# EAGLE design A4988Board (EAGLE 9.4.2)
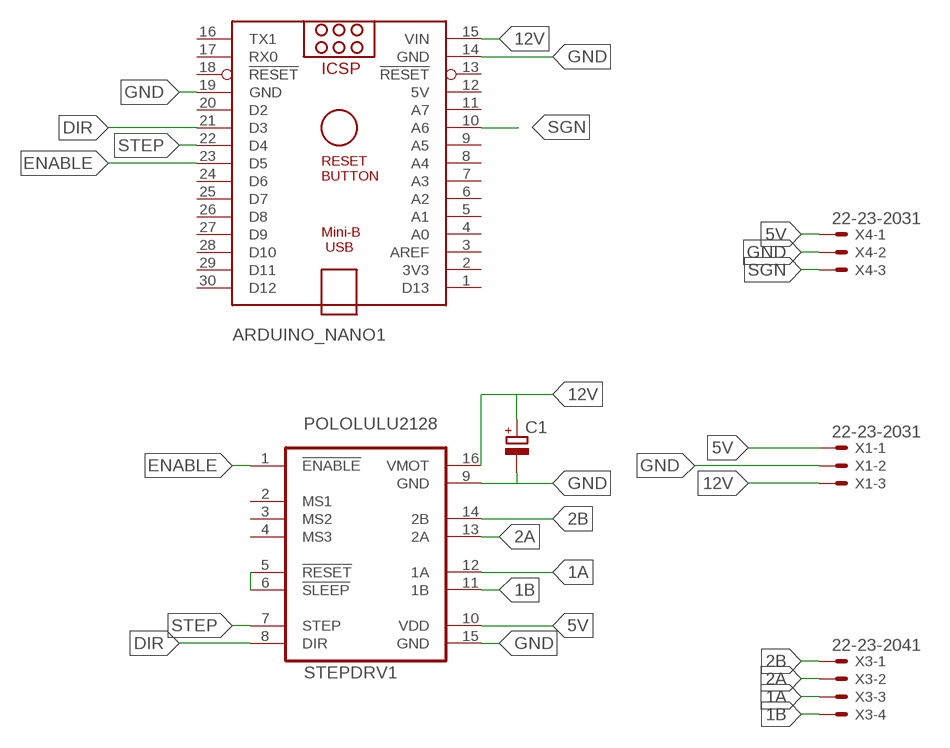
[diagram p0: schematic, sheet 1]

## Parts
ARDUINO_NANO1  ARDUINO_NANO  [ARDUINO_NANO]
C1  CPOL-EUE2.5-6  [E2,5-6]
STEPDRV1  POLOLULU2128  [POLOLULU2128]
X1  22-23-2031  [22-23-2031]
X3  22-23-2041  [22-23-2041]
X4  22-23-2031  [22-23-2031]

## Nets
1A: STEPDRV1.12(1A) X3.3
1B: STEPDRV1.11(1B) X3.4
2A: STEPDRV1.13(2A) X3.2
2B: STEPDRV1.14(2B) X3.1
5V: STEPDRV1.10(VDD) X1.1 X4.1
12V: ARDUINO_NANO1.15(VIN) C1.+ STEPDRV1.16(VMOT) X1.3
DIR: ARDUINO_NANO1.21(D3) STEPDRV1.8(DIR)
ENABLE: ARDUINO_NANO1.23(D5) STEPDRV1.1(!ENABLE)
GND: ARDUINO_NANO1.14(GND) ARDUINO_NANO1.19(GND) C1.- STEPDRV1.9(GND) STEPDRV1.15(GND) X1.2 X4.2
N$2: STEPDRV1.5(!RESET) STEPDRV1.6(!SLEEP)
SGN: ARDUINO_NANO1.10(A6) X4.3
STEP: ARDUINO_NANO1.22(D4) STEPDRV1.7(STEP)
Unconnected: ARDUINO_NANO1.1(D13) ARDUINO_NANO1.2(3V3) ARDUINO_NANO1.3(AREF) ARDUINO_NANO1.4(A0) ARDUINO_NANO1.5(A1) ARDUINO_NANO1.6(A2) ARDUINO_NANO1.7(A3) ARDUINO_NANO1.8(A4) ARDUINO_NANO1.9(A5) ARDUINO_NANO1.11(A7) ARDUINO_NANO1.13(!RESET) ARDUINO_NANO1.16(TX1) ARDUINO_NANO1.17(RX0) ARDUINO_NANO1.18(!RESET) ARDUINO_NANO1.20(D2) ARDUINO_NANO1.24(D6) ARDUINO_NANO1.25(D7) ARDUINO_NANO1.26(D8) ARDUINO_NANO1.27(D9) ARDUINO_NANO1.28(D10) ARDUINO_NANO1.29(D11) ARDUINO_NANO1.30(D12) STEPDRV1.2(MS1) STEPDRV1.3(MS2) STEPDRV1.4(MS3)

## Power pins joined to a net without a drawn wire
5V: ARDUINO_NANO1.12(5V)

## Library data of the parts
ARDUINO_NANO1 = ArduinoNanoV30:ARDUINO_NANO: Arduino Nano V3.0 Overview: The Arduino Nano is a small, complete, and breadboard-friendly board based on the ATmega328 (Arduino Nano 3.x) or ATmega168 (Arduino Nano 2.x). It has more or less the same functionality of the Arduino Duemilanove, but in a different package. It lacks only a DC power jack, and works with a Mini-B USB cable instead of a standard one. The Nano was designed and is being produced by Gravitech. Specifications: Microcontroller Atmel ATmega168 or ATmega328 Operating Voltage (logic level) 5 V Input Voltage (recommended) 7-12 V Input Voltage (limits) 6-20 V Digital I/O Pins 14 (of which 6 provide PWM output) Analog Input Pins 8 DC Current per I/O Pin 40 mA Flash Memory 16 KB (ATmega168) or 32 KB (ATmega328) of which 2 KB used by bootloader SRAM 1 KB (ATmega168) or 2 KB (ATmega328) EEPROM 512 bytes (ATmega168) or 1 KB (ATmega328) Clock Speed 16 MHz Dimensions 0.73" x 1.70" Length 45 mm Width 18 mm Weigth 5 g Power: The Arduino Nano can be powered via the Mini-B USB connection, 6-20V unregulated external power supply (pin 30), or 5V regulated external power supply (pin 27). The power source is automatically selected to the highest voltage source. Memory: The ATmega168 has 16 KB of flash memory for storing code (of which 2 KB is used for the bootloader); the ATmega328 has 32 KB, (also with 2 KB used for the bootloader). The ATmega168 has 1 KB of SRAM and 512 bytes of EEPROM (which can be read and written with the EEPROM library); the ATmega328 has 2 KB of SRAM and 1 KB of EEPROM. Input and Output: Each of the 14 digital pins on the Nano can be used as an input or output, using pinMode(), digitalWrite(), and digitalRead() functions. They operate at 5 volts. Each pin can provide or receive a maximum of 40 mA and has an internal pull-up resistor (disconnected by default) of 20-50 kOhms. In addition, some pins have specialized functions. Visit Arduino - ArduinoBoardNano <https://www.arduino.cc/en/Main/ArduinoBoardNano>
C1 = rcl:CPOL-EU: POLARIZED CAPACITOR, European symbol; SPICEPREFIX: C
STEPDRV1 = stepper_drivers_etc:POLOLULU2128
X1 X4 = con-molex:22-23-2031: .100" (2.54mm) Center Header - 3 Pin; MF: MOLEX; MPN: 22-23-2031; OC_FARNELL: 1462950; OC_NEWARK: 30C0862
X3 = con-molex:22-23-2041: .100" (2.54mm) Center Header - 4 Pin; MF: MOLEX; MPN: 22-23-2041; OC_FARNELL: 1462920; OC_NEWARK: 38C0355

## Board
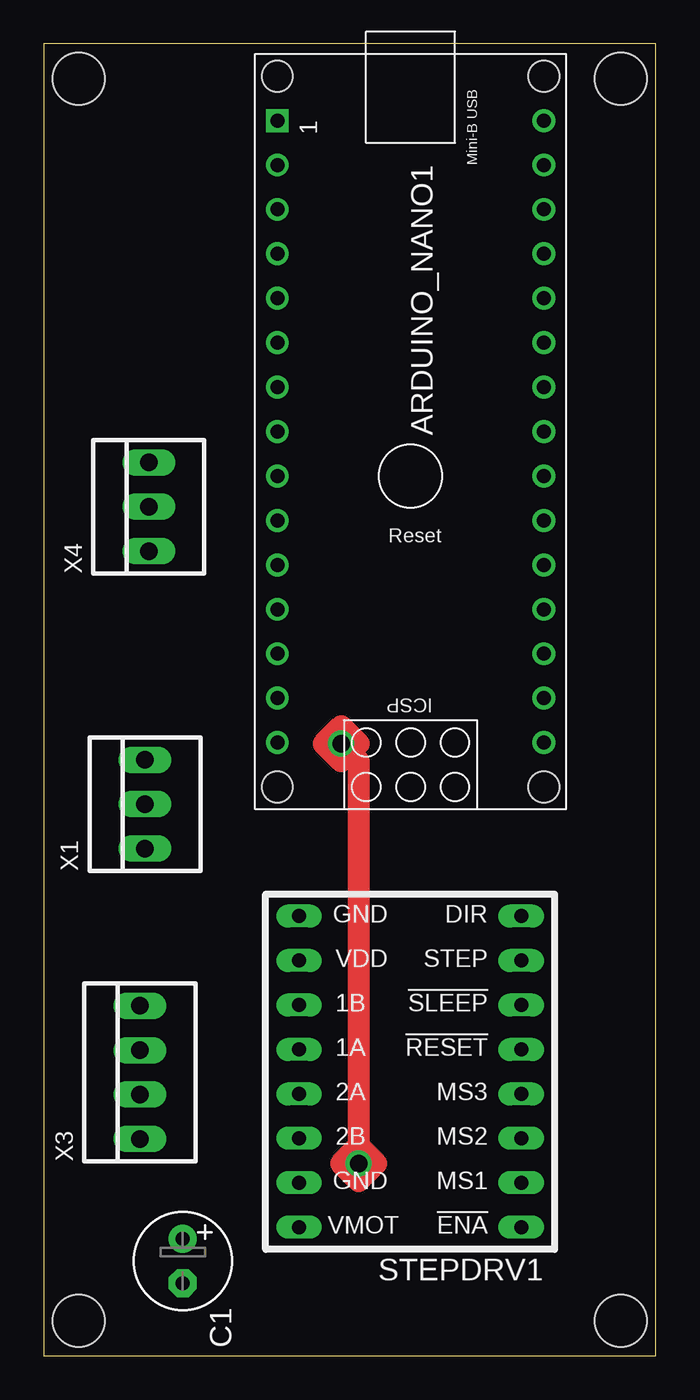
[diagram p1: board, top side]
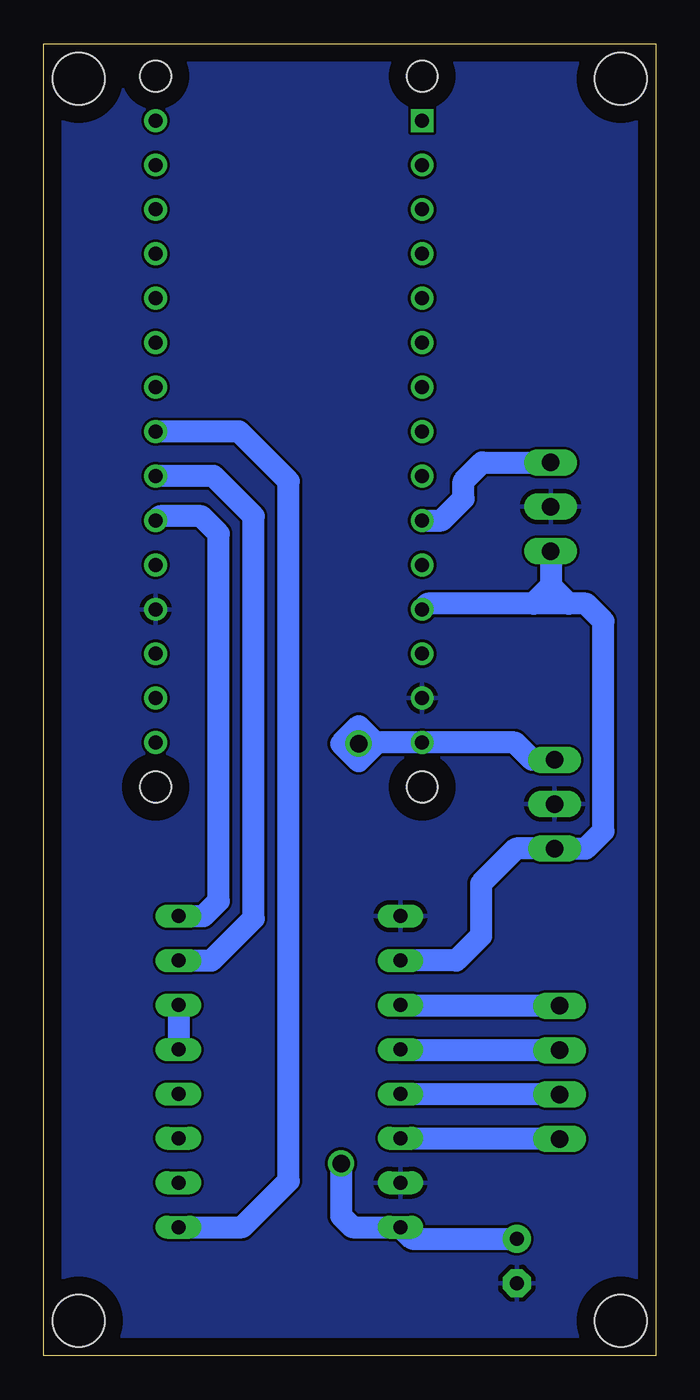
[diagram p2: board, bottom side, seen from below]

Size 35 x 75 mm. Coordinates in mm from the lower left corner, seen from the top.
Outline: 0,0 35,0 35,75 0,75 0,0
Copper layers (1*16): Top 0.035mm / dielectric 1.5mm / Bottom 0.035mm
Design rules "default": minimum track width 6mil, minimum drill 0.35mm, track to track 6mil, track to pad 6mil, pad to pad 6mil, via to via 6mil, smd to smd 6mil, copper to edge 40mil, drill to drill 6mil, minimum pad ring 10mil, minimum via ring 8mil, stop-mask expansion 4mil, vias tented up to drill 0mil, thermal gap 10mil
Holes 3 mm at 2,2 33,2 33,73 2,73

### Footprints (pad centres in the part's own frame; a part is rotated, then mirrored left to right if it is on the bottom)
ARDUINO_NANO = drill 0.8 square: 1 -20.32,-7.62 | drill 0.8: 2 -17.78,-7.62; 3 -15.24,-7.62; 4 -12.7,-7.62; 5 -10.16,-7.62; 6 -7.62,-7.62; 7 -5.08,-7.62; 8 -2.54,-7.62; 9 0,-7.62; 10 2.54,-7.62; 11 5.08,-7.62; 12 7.62,-7.62; 13 10.16,-7.62; 14 12.7,-7.62; 15 15.24,-7.62; 16 15.24,7.62; 17 12.7,7.62; 18 10.16,7.62; 19 7.62,7.62; 20 5.08,7.62; 21 2.54,7.62; 22 0,7.62; 23 -2.54,7.62; 24 -5.08,7.62; 25 -7.62,7.62; 26 -10.16,7.62; 27 -12.7,7.62; 28 -15.24,7.62; 29 -17.78,7.62; 30 -20.32,7.62 | hole 1.778: -22.86,-7.62; -22.86,7.62; 17.78,7.62; 17.78,-7.62
E2,5-6 = drill 0.813 pad 1.6: + -1.27,0 | drill 0.813 pad 1.6 octagon: - 1.27,0
POLOLULU2128 = drill 0.8 long: 1 -7.62,7.62; 2 -7.62,5.08; 3 -7.62,2.54; 4 -7.62,0; 5 -7.62,-2.54; 6 -7.62,-5.08; 7 -7.62,-7.62; 8 -7.62,-10.16; 9 5.08,-10.16; 10 5.08,-7.62; 11 5.08,-5.08; 12 5.08,-2.54; 13 5.08,0; 14 5.08,2.54; 15 5.08,5.08; 16 5.08,7.62
22-23-2031 = drill 1 long: 1 -2.54,0; 2 0,0; 3 2.54,0
22-23-2041 = drill 1 long: 1 -3.81,0; 2 -1.27,0; 3 1.27,0; 4 3.81,0

### Placement (x,y rotation side)
ARDUINO_NANO1  20.98,50.29 270 top
C1  7.95,5.42 270 top
STEPDRV1  19.68,14.97 180 top
X1  5.79,31.53 90 top
X3  5.5,16.2 90 top
X4  6.01,48.53 90 top

### Tracks (layer width: path | path; a pad name or v marks a point on that pad's centre or on a via)
1A
  Bottom 1.27: X3.3 14.56,17.47 STEPDRV1.12
1B
  Bottom 1.27: X3.4 14.56,20.01 STEPDRV1.11
2A
  Bottom 1.27: X3.2 14.56,14.93 STEPDRV1.13
2B
  Bottom 1.27: X3.1 14.56,12.39 STEPDRV1.14
5V
  Bottom 1.27: STEPDRV1.10 11.41,22.59 10,24 10,27 8,29 7.99,28.99 X1.1 4.01,28.99 3,30 3,42 4,43 5,43 | 5,43 7,43 | 7,43 13.03,43 ARDUINO_NANO1.12 | X4.1 6.01,44.01 | 6.01,44.01 5,43 | 6.01,44.01 6.01,43.99 7,43
12V  (via drill 1)
  Top 1.27: 16,35 v17,35 18,34 18,12 | 16,35 17,36 18,35 17,34 16,35 | v18,11 18,10 | v18,11 19,11 | v18,11 17,11 | 17,11 18,12 | 18,12 19,11 | 19,11 18,10 | 18,10 17,11
  Bottom 1.27: C1.+ 13.94,6.69 STEPDRV1.16 17.35,7.35 18,8 v18,11 | X1.3 7.07,34.07 8.05,35.05 ARDUINO_NANO1.15 16,35.05 | v17,35 17,36 | v17,35 18,35 | v17,35 17,34 | 17,34 16,35 16,35.05 | 16,35.05 16.05,35.05 17,36 | 17,36 18,35 | 18,35 17,34
DIR
  Bottom 1.27: STEPDRV1.8 25.87,25.13 25,26 25,47 26,48 28.35,48 ARDUINO_NANO1.21
ENABLE
  Bottom 1.27: STEPDRV1.1 23.65,7.35 21,10 21,50 23.83,52.83 ARDUINO_NANO1.23
GND
  pour Bottom: -27,-9 -27,107 -22,112 66,112 71,107 71,-5 68,-8 58,-18 -17,-18 -19,-18 -27,-10
N$2
  Bottom 1.27: STEPDRV1.6 STEPDRV1.5
SGN
  Bottom 1.27: ARDUINO_NANO1.10 12.25,47.75 11,49 11,50 9.93,51.07 X4.3
STEP
  Bottom 1.27: STEPDRV1.7 25.41,22.59 23,25 23,48 25.29,50.29 ARDUINO_NANO1.22